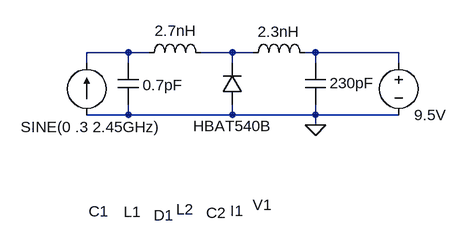
[diagram p0: schematic Draft1.asc]
Draft1.asc, the LTspice schematic file:
Version 4
SHEET 1 880 680
WIRE 144 144 80 144
WIRE 176 144 144 144
WIRE 304 144 256 144
WIRE 336 144 304 144
WIRE 432 144 416 144
WIRE 560 144 432 144
WIRE 80 160 80 144
WIRE 144 160 144 144
WIRE 304 160 304 144
WIRE 432 160 432 144
WIRE 560 160 560 144
WIRE 144 240 144 224
WIRE 144 240 80 240
WIRE 304 240 304 224
WIRE 304 240 144 240
WIRE 432 240 432 224
WIRE 432 240 304 240
WIRE 560 240 432 240
WIRE 432 256 432 240
FLAG 432 256 0
SYMBOL current 80 240 R180
WINDOW 0 -241 -148 Left 2
WINDOW 3 -113 -19 Left 2
WINDOW 123 0 0 Left 2
WINDOW 39 0 0 Left 2
SYMATTR InstName I1
SYMATTR Value SINE(0 .3 2.45GHz)
SYMBOL diode 320 224 R180
WINDOW 0 106 -171 Left 2
WINDOW 3 -44 -33 Left 2
SYMATTR InstName D1
SYMATTR Value HBAT540B
SYMBOL ind 160 160 R270
WINDOW 0 -245 -10 VTop 2
WINDOW 3 65 57 VBottom 2
SYMATTR InstName L1
SYMATTR Value 2.7nH
SYMBOL cap 128 160 R0
WINDOW 0 -45 229 Left 2
WINDOW 3 38 34 Left 2
SYMATTR InstName C1
SYMATTR Value 0.7pF
SYMBOL ind 320 160 R270
WINDOW 0 -241 -89 VTop 2
WINDOW 3 64 55 VBottom 2
SYMATTR InstName L2
SYMATTR Value 2.3nH
SYMBOL voltage 560 144 R0
WINDOW 0 -225 235 Left 2
WINDOW 123 0 0 Left 2
WINDOW 39 0 0 Left 2
SYMATTR InstName V1
SYMATTR Value 9.5V
SYMBOL cap 416 160 R0
WINDOW 0 -152 231 Left 2
WINDOW 3 38 31 Left 2
SYMATTR InstName C2
SYMATTR Value 230pF

The netlist it stands for:
* Draft1.asc
I1 0 N001 SINE(0 .3 2.45GHz)
D1 0 N002 HBAT540B
L1 N001 N002 2.7nH
C1 N001 0 0.7pF
L2 N002 N003 2.3nH
V1 N003 0 9.5V
C2 N003 0 230pF
.model D D
.lib standard.dio
.backanno
.end